# EAGLE schematic Placa_SecadorDeGraos_SL (EAGLE 9.2.0)
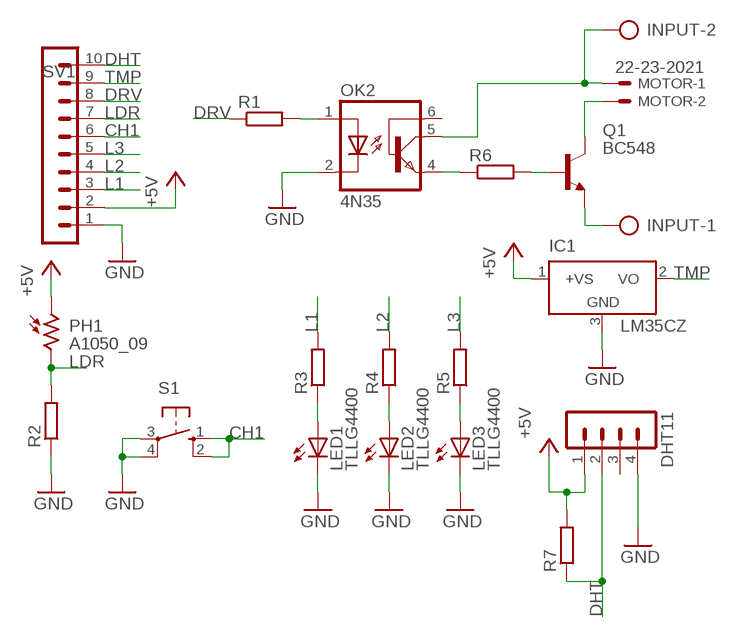
[diagram p0: schematic, sheet 1]

## Parts
DHT11  MA04-1  [MA04-1]
IC1  LM35CZ  [TO92]
INPUT  AK500/2  [AK500/2]
LED1  TLLG4400  [LED3MM]
LED2  TLLG4400  [LED3MM]
LED3  TLLG4400  [LED3MM]
MOTOR  22-23-2021  [22-23-2021]
OK2  4N35  [DIL06]
PH1  A1050_09  [T0-46-A10XX]
Q1  BC548  [TO92-EBC]
R1  R-EU_0204/7  [0204/7]
R2  R-EU_0204/7  [0204/7]
R3  R-EU_0204/7  [0204/7]
R4  R-EU_0204/7  [0204/7]
R5  R-EU_0204/7  [0204/7]
R6  R-EU_0204/7  [0204/7]
R7  R-EU_0204/7  [0204/7]
S1  10-XX  [B3F-10XX]
SV1  MA10-1  [MA10-1]

## Nets
+5V: DHT11.1 IC1.1(+VS) PH1.1 R7.2 SV1.2
CH1: S1.1(S) S1.2(S1) SV1.6
DHT: DHT11.2 R7.1 SV1.10
DRV: R1.1 SV1.8
GND: DHT11.4 IC1.3(GND) LED1.K(C) LED2.K(C) LED3.K(C) OK2.2(C) R2.1 S1.3(P) S1.4(P1) SV1.1
L1: R3.2 SV1.3
L2: R4.2 SV1.4
L3: R5.2 SV1.5
LDR: PH1.2 R2.2 SV1.7
N$1: LED1.A R3.1
N$2: LED2.A R4.1
N$3: LED3.A R5.1
N$4: MOTOR.2 Q1.C
N$5: OK2.1(A) R1.2
N$6: Q1.B R6.2
N$7: OK2.4(EMI) R6.1
N$8: INPUT.2 MOTOR.1 OK2.5(COL)
N$10: INPUT.1 Q1.E
TMP: IC1.2(VO) SV1.9
Unconnected: DHT11.3 OK2.6(BAS)

## Library data of the parts
DHT11 = con-lstb:MA04-1: PIN HEADER; OC_FARNELL: unknown; OC_NEWARK: unknown
IC1 = lm35:LM35: Single-Supply Centigrade Temperature Sensor Vout = (10mV/°C x Temp °C) +5mmmV Source: http://www.national.com/ds/LM/LM35.pdf
INPUT = con-ptr500:AK500/2: CONNECTOR; OC_FARNELL: unknown; OC_NEWARK: unknown
LED1-LED3 = led:TLLG4400: Low Current (2mA) LED 3 mm Tinted Diffused Package color GREEN Source: Data sheet <http://www.farnell.com/datasheets/391098.pdf>; MF: VISHAY SEMICONDUCTOR; OC_FARNELL: 1612435
MOTOR = con-molex:22-23-2021: .100" (2.54mm) Center Header - 2 Pin; MF: MOLEX; MPN: 22-23-2021; OC_FARNELL: 1462926; OC_NEWARK: 25C3832
OK2 = optocoupler:4N35: MOTOROLA OPTO COUPLER; MF: FAIRCHILD SEMICONDUCTOR; MPN: 4N35; OC_FARNELL: 1328375; OC_NEWARK: 72K9946
PH1 = photo-elements:A10: Sensor Robust Light Sensing Applications Outdoor Light Sensing Application Source: http://optoelectronics.perkinelmer.com/content/Datasheets/DTS_PhotocellsA1050.pdf
Q1 = transistor-npn:BC548*: NPN Transistor
R1-R7 = rcl:R-EU_: RESISTOR, European symbol; SPICEPREFIX: R
S1 = switch-omron:10-XX: OMRON SWITCH; MPN: B3F-1000; OC_FARNELL: 176432; OC_NEWARK: 36M3542
SV1 = con-lstb:MA10-1: PIN HEADER; OC_FARNELL: unknown; OC_NEWARK: unknown